# EAGLE design 14140^3 (EAGLE 7.5.0)
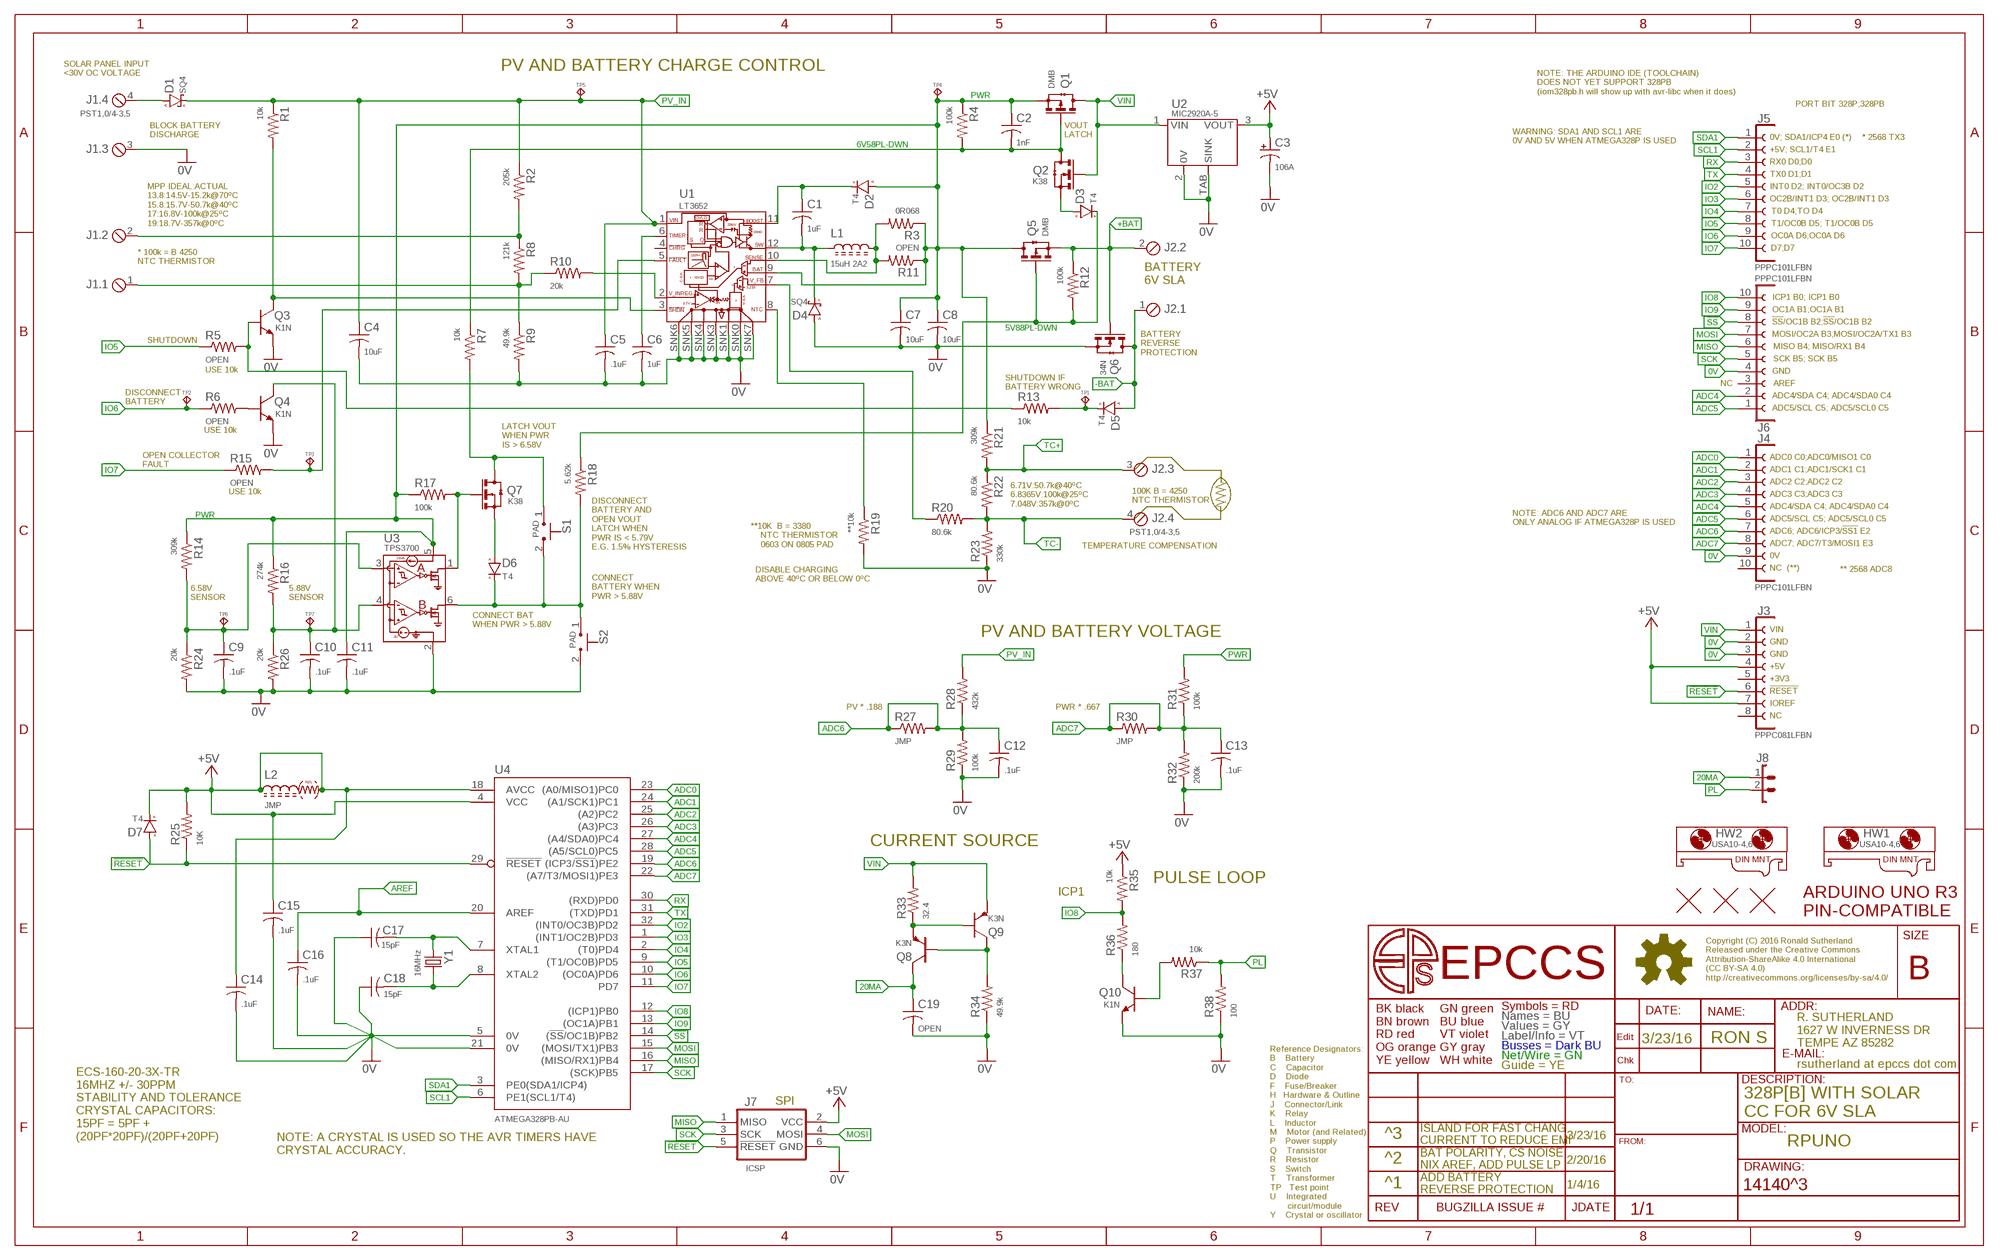
[diagram p0: schematic, sheet 1]

## Parts
C1  1uF  CC0805A  [C0805(2012)]
C2  1nF  CC0603A  [C0603(1608)]
C3  106A  CT1206  [3216]
C4  10uF  CC1206  [C1206(3216)]
C5  .1uF  CC0805A  [C0805(2012)]
C6  1uF  CC0805A  [C0805(2012)]
C7  10uF  CC1206  [C1206(3216)]
C8  10uF  CC1206  [C1206(3216)]
C9  .1uF  CC0603A  [C0603(1608)]
C10  .1uF  CC0603A  [C0603(1608)]
C11  .1uF  CC0603A  [C0603(1608)]
C12  .1uF  CC0603A  [C0603(1608)]
C13  .1uF  CC0603A  [C0603(1608)]
C14  .1uF  CC0603A  [C0603(1608)]
C15  .1uF  CC0603A  [C0603(1608)]
C16  .1uF  CC0603A  [C0603(1608)]
C17  15pF  CC0603A  [C0603(1608)]
C18  15pF  CC0603A  [C0603(1608)]
C19  OPEN  CC0805A  [C0805(2012)]
D1  SQ4  DSMA  [SMA]
D2  T4  DSOD123  [SOD123]
D3  T4  DSOD123  [SOD123]
D4  SQ4  DSMA  [SMA]
D5  T4  DSOD123  [SOD123]
D6  T4  DSOD123  [SOD123]
D7  T4  DSOD123  [SOD123]
HW1  USA10-4,6  MOUNT-HOLE5.0  [USA10]
HW2  USA10-4,6  MOUNT-HOLE5.0  [USA10]
J1  PST1,0/4-3,5  MCV4  [MCV4]
J2  PST1,0/4-3,5  MCV4  [MCV4]
J3  PPPC081LFBN  F1X8  [F1X8]
J4  PPPC101LFBN  F1X10  [F1X10]
J5  PPPC101LFBN  F1X10  [F1X10]
J6  PPPC101LFBN  F1X10  [F1X10]
J7  ICSP  ISP-SPIPTH  [ISP]
J8  1X2  [1X2]
L1  15uH 2A2  L3939  [L3939]
L2  JMP  L0805  [C0805(2012)]
Q1  DMB  N-CHSOT23  [SOT23]
Q2  K38  N-CHSOT23  [SOT23]
Q3  K1N  NPNSOT23  [SOT23]
Q4  K1N  NPNSOT23  [SOT23]
Q5  DMB  N-CHSOT23  [SOT23]
Q6  34N  N-CHSOT23  [SOT23]
Q7  K38  N-CHSOT23  [SOT23]
Q8  K3N  PNPSOT23  [SOT23]
Q9  K3N  PNPSOT23  [SOT23]
Q10  K1N  NPNSOT23  [SOT23]
R1  10k  R0805  [C0805(2012)]
R2  205k  R0805  [C0805(2012)]
R3  0R068  R1210  [C1210(3225)]
R4  100k  R0805  [C0805(2012)]
R5  OPEN  R0805  [C0805(2012)]
R6  OPEN  R0805  [C0805(2012)]
R7  10k  R0805  [C0805(2012)]
R8  121k  R0805  [C0805(2012)]
R9  49.9k  R0805  [C0805(2012)]
R10  20k  R0805  [C0805(2012)]
R11  OPEN  R1210  [C1210(3225)]
R12  100k  R0805  [C0805(2012)]
R13  10k  R0805  [C0805(2012)]
R14  309k  R0805  [C0805(2012)]
R15  OPEN  R0805  [C0805(2012)]
R16  274k  R0805  [C0805(2012)]
R17  100k  R0805  [C0805(2012)]
R18  5.62k  R0805  [C0805(2012)]
R19  **10k  R0805  [C0805(2012)]
R20  80.6k  R0805  [C0805(2012)]
R21  309k  R0805  [C0805(2012)]
R22  80.6k  R0805  [C0805(2012)]
R23  330k  R0805  [C0805(2012)]
R24  20k  R0805  [C0805(2012)]
R25  10K  R0805  [C0805(2012)]
R26  20k  R0805  [C0805(2012)]
R27  JMP  R0805  [C0805(2012)]
R28  432k  R0805  [C0805(2012)]
R29  100k  R0805  [C0805(2012)]
R30  JMP  R0805  [C0805(2012)]
R31  100k  R0805  [C0805(2012)]
R32  200k  R0805  [C0805(2012)]
R33  32.4  R0805  [C0805(2012)]
R34  49.9k  R0805  [C0805(2012)]
R35  10k  R0805  [C0805(2012)]
R36  180  R0805  [C0805(2012)]
R37  10k  R0805  [C0805(2012)]
R38  100  R0805  [C0805(2012)]
S1  PAD  TAC_SWSMD  [C0805(2012)]
S2  PAD  TAC_SWSMD  [C0805(2012)]
TP1  TPPAD1-08  [P1-08]
TP2  TPPAD1-08  [P1-08]
TP3  TPPAD1-08  [P1-08]
TP4  TPPAD1-08  [P1-08]
TP5  TPPAD1-08  [P1-08]
TP6  TPPAD1-08  [P1-08]
TP7  TPPAD1-08  [P1-08]
U1  LT3652  [12MSOP-EDP-HAND]
U2  MIC2920A-5  MIC2920SOT223  [SOT223]
U3  TPS3700  TPS3700DDCR  [SOT23-6]
U4  ATMEGA328PB-AU  [TQFP32-08]
U$1  ARDUINO-UNO  [ARDUINO_UNO]
U$2  FIDUCIAL1.27  [FIDUCIAL-1.27]
U$3  FIDUCIAL1.27  [FIDUCIAL-1.27]
U$4  FIDUCIAL1.27  [FIDUCIAL-1.27]
Y1  16MHz  CSM-3X  [CSM-3X]

## Nets
0V: C3.- C4.2 C5.2 C6.2 C7.2 C8.2 C9.2 C10.2 C11.2 C12.2 C13.2 C14.2 C15.2 C16.2 C17.1 C18.1 C19.2 D4.A J1.3 J3.2 J3.3 J4.9 J6.4 J7.6(GND) Q3.E Q4.E Q6.2(S)(S) Q10.E R9.2 R19.2 R23.1 R24.2 R26.2 R29.1 R32.1 R34.1 R38.1 S2.2 U1.SNK0(0V) U1.SNK1(0V) U1.SNK3(0V) U1.SNK4(0V) U1.SNK5(0V) U1.SNK6(0V) U1.SNK7(0V) U2.2(0V) U2.TAB(SINK) U3.2(0V) U4.5(0V) U4.21(0V)
5V88PL-DWN: D3.C(K) Q5.1(G)(G) R12.2 R18.1
6V58PL-DWN: C2.2 Q1.1(G)(G) Q2.3(D)(D) R4.2 R7.1
20MA: C19.1 J8.1 Q8.C
!FAULT: R15.2 TP3.TP U1.5(!FAULT)
!RESET!: D7.A J3.6 J7.5(!RESET) R25.1 U4.29(!RESET)
!SS: J6.8 U4.14((!SS!/OC1B)PB2)
+5V: C3.+ C14.1 C15.1 D7.C(K) J3.4 J3.7 J7.2(VCC) L2.1 L2.2 R25.2 R35.1 U2.3(VOUT) U4.4(VCC) U4.18(AVCC)
+BAT: J2.2 Q5.2(S)(S) Q6.1(G)(G) R12.1
-BAT: D5.A J2.1 Q6.3(D)(D)
ADC0: J4.1 U4.23((A0/MISO1)PC0)
ADC1: J4.2 U4.24((A1/SCK1)PC1)
ADC2: J4.3 U4.25((A2)PC2)
ADC3: J4.4 U4.26((A3)PC3)
ADC4: J4.5 J6.2 U4.27((A4/SDA0)PC4)
ADC5: J4.6 J6.1 U4.28((A5/SCL0)PC5)
ADC6: C12.1 J4.7 R27.1 R27.2 R28.1 R29.2 U4.19((ICP3/!SS1!)PE2)
ADC7: C13.1 J4.8 R30.1 R30.2 R31.1 R32.2 U4.22((A7/T3/MOSI1)PE3)
AREF: C16.1 U4.20(AREF)
IO2: J5.5 U4.32((INT0/OC3B)PD2)
IO3: J5.6 U4.1((INT1/OC2B)PD3)
IO4: J5.7 U4.2((T0)PD4)
IO5: J5.8 R5.1 U4.9((T1/OC0B)PD5)
IO6: J5.9 R6.1 TP2.TP U4.10((OC0A)PD6)
IO7: J5.10 R15.1 U4.11(PD7)
IO8: J6.10 R35.2 R36.2 U4.12((ICP1)PB0)
IO9: J6.9 U4.13((OC1A)PB1)
MISO: J6.6 J7.1(MISO) U4.16((MISO/RX1)PB4)
MOSI: J6.7 J7.4(MOSI) U4.15((MOSI/TX1)PB3)
N$1: C6.1 U1.6(TIMER)
N$2: R20.1 U1.7(V_FB)
N$3: J1.1 R8.2 R9.1 R10.1
N$4: Q3.C R1.2 U1.3(!SHDN)
N$5: D1.A J1.4
N$6: Q4.B R6.2
N$7: C10.1 Q4.C R16.2 R26.1 TP7.TP U3.4(INB)
N$8: D3.A Q2.2(S)(S)
N$9: J1.2 R2.2 R8.1
N$10: C1.1 D2.C(K) U1.11(BOOST)
N$11: R10.2 U1.2(V_INREG)
N$12: Q8.E Q9.B R33.1
N$13: D5.C(K) R13.2 TP1.TP
N$14: D6.A Q7.2(S)(S)
N$15: C9.1 R14.2 R24.1 TP6.TP U3.3(INA)
N$16: Q7.1(G)(G) R17.2 U3.1(OUTA)
N$17: D6.C(K) R18.2 S1.2 S2.1 U3.6(OUTB)
N$18: Q7.3(D)(D) R7.2 S1.1
N$19: Q8.B Q9.C R34.2
N$21: Q10.B R37.2
N$22: Q10.C R36.1
N$46: Q3.B R5.2 R13.1
N$115: C17.2 U4.7(XTAL1) Y1.1
N$116: C18.2 U4.8(XTAL2) Y1.2
NTC1: R19.1 U1.8(NTC)
PL: J8.2 R37.1 R38.2
PV_IN: C4.1 C5.1 D1.K R1.1 R2.1 R28.2 TP5.TP U1.1(VIN)
PWR: C2.1 C7.1 C8.1 C11.1 D2.A Q1.2(S)(S) Q5.3(D)(D) R3.1 R4.1 R11.1 R14.1 R16.1 R17.1 R21.1 R31.2 TP4.TP U1.9(BAT) U3.5(VDD)
RX: J5.3 U4.30((RXD)PD0)
SCK: J6.5 J7.3(SCK) U4.17((SCK)PB5)
SCL1: J5.2 U4.6(PE1(SCL1/T4))
SDA1: J5.1 U4.3(PE0(SDA1/ICP4))
SENSE: L1.2 R3.2 R11.2 U1.10(SENSE)
SW: C1.2 D4.K L1.1 U1.12(SW)
TC+: J2.3 R21.2 R22.1
TC-: J2.4 R20.2 R22.2 R23.2
TX: J5.4 U4.31((TXD)PD1)
VIN: J3.1 Q1.3(D)(D) Q2.1(G)(G) Q9.E R33.2 U2.1(VIN)
Unconnected: J3.5 J3.8 J4.10 J6.3 U1.4(!CHRG)

## Notes on the sheet
- PV AND BATTERY CHARGE CONTROL
- SOLAR PANEL INPUT
  <30V OC VOLTAGE
- NOTE: THE ARDUINO IDE (TOOLCHAIN)
  DOES NOT YET SUPPORT 328PB
  (iom328pb.h will show up with avr-libc when it does)
- PORT BIT 328P;328PB
- BLOCK BATTERY
  DISCHARGE
- VOUT 
  LATCH
- 0V; SDA1/ICP4 E0 (*) | * 2568 TX3
- WARNING: SDA1 AND SCL1 ARE 
  0V AND 5V WHEN ATMEGA328P IS USED
- +5V; SCL1/T4 E1
- RX0 D0;D0
- TX0 D1;D1
- INT0 D2; INT0/OC3B D2
- OC2B/INT1 D3; OC2B/INT1 D3
- T0 D4;TO D4
- MPP IDEAL:ACTUAL
  13.8:14.5V-15.2k@70ºC
  15.8:15.7V-50.7k@40ºC
  17:16.8V-100k@25ºC
  19:18.7V-357k@0ºC
- T1/OC0B D5; T1/OC0B D5
- OC0A D6;OC0A D6
- D7;D7
- * 100k = B 4250
  NTC THERMISTOR
- BATTERY
  6V SLA
- ICP1 B0; ICP1 B0
- OC1A B1;OC1A B1
- !SS!/OC1B B2;!SS!/OC1B B2
- MOSI/OC2A B3;MOSI/OC2A/TX1 B3
- SHUTDOWN
- MISO B4; MISO/RX1 B4
- BATTERY
  REVERSE 
  PROTECTION
- SCK B5; SCK B5
- USE 10k | GND
- NC | AREF
- SHUTDOWN IF
  BATTERY WRONG
- ADC4/SDA C4; ADC4/SDA0 C4
- DISCONNECT 
  BATTERY
- ADC5/SCL C5; ADC5/SCL0 C5
- USE 10k
- LATCH VOUT
  WHEN PWR 
  IS > 6.58V
- ADC0 C0;ADC0/MISO1 C0
- OPEN COLLECTOR
  FAULT
- ADC1 C1;ADC1/SCK1 C1
- ADC2 C2;ADC2 C2
- USE 10k
- ADC3 C3;ADC3 C3
- 100K B = 4250
  NTC THERMISTOR
- 6.71V:50.7k@40ºC
  6.8365V:100k@25ºC
  7.048V:357k@0ºC
- ADC4/SDA C4; ADC4/SDA0 C4
- ADC5/SCL C5; ADC5/SCL0 C5
- NOTE: ADC6 AND ADC7 ARE 
  ONLY ANALOG IF ATMEGA328P IS USED
- ADC6; ADC6/ICP3/!SS1! E2
- ADC7; ADC7/T3/MOSI1 E3
- **10K  B = 3380
      NTC THERMISTOR
      0603 ON 0805 PAD
- TEMPERATURE COMPENSATION
- DISCONNECT 
  BATTERY AND 
  OPEN VOUT 
  LATCH WHEN 
  PWR IS < 5.79V
  E.G. 1.5% HYSTERESIS
- 0V
- NC  (**) | ** 2568 ADC8
- DISABLE CHARGING
  ABOVE 40ºC OR BELOW 0ºC
- CONNECT 
  BATTERY WHEN
  PWR > 5.88V
- 6.58V
  SENSOR
- 5.88V 
  SENSOR
- CONNECT BAT
  WHEN PWR > 5.88V
- VIN
- PV AND BATTERY VOLTAGE
- GND
- GND
- +5V
- +3V3
- !RESET
- IOREF
- PV * .188 | PWR * .667
- NC
- CURRENT SOURCE
- PULSE LOOP
- ICP1
- 3/23/16 | RON S
- SPI
- 328P[B] WITH SOLAR 
  CC FOR 6V SLA
- ^3 | 3/23/16
- ECS-160-20-3X-TR
  16MHZ +/- 30PPM
  STABILITY AND TOLERANCE
  CRYSTAL CAPACITORS:
  15PF = 5PF +
  (20PF*20PF)/(20PF+20PF)
- ISLAND FOR FAST CHANG
  CURRENT TO REDUCE EMI
- RPUNO
- NOTE: A CRYSTAL IS USED SO THE AVR TIMERS HAVE 
  CRYSTAL ACCURACY.
- ^2 | 2/20/16
- BAT POLARITY, CS NOISE
  NIX AREF, ADD PULSE LP
- ^1 | 1/4/16
- ADD BATTERY 
  REVERSE PROTECTION

## Library data of the parts
C1 C2 C4-C19 = C-C:C: CAPACITOR Symbol
C3 = C-T:CT: Tantalum Electrolytic Capacitor
D1 D4 = D-SBR:D: DIODE
D2 D3 D5-D7 = D-GP:D: DIODE
HW1 HW2 = HW-DINMnt:MOUNT-HOLE: USA10-4.6 [PhxCont,1202713] DINRAIL ADAPTER UNIVERSAL 10MM 4.6MM
J1 J2 = J-HDR3.5mm:MCV4: MCV 1,5/4-G-3,5-RN [PHOENIX CONTACT,1843622] CONN HEADER SHROUDED 2POS 3.5MM PST 1,0/4-3,5 [PHOENIX CONTACT,1945119] CONN HEADER STRIP PIN 4POS 3.5MM MCVR 1,5& 4-ST-3,5 [PHOENIX CONTACT,1863178] CONN PLUG 4POS SCREW 3.5MM
J3 = J-HDR2.54mm:F1X8: FEMALE HEADER 8POS
J4-J6 = J-HDR2.54mm:F1X10: FEMALE HEADER 10POS
J7 = U-AVR:ISP-SPI: AVR ISP thru SPI In-System Programming uses the target Atmel AVR’s internal SPI (Serial Peripheral Interface) to download code into the flash and EEPROM memories. It is not a debugging interface. When designing an application PCB which includes an AVR with the SPI interface, this pinout should be used. Sparkfun SKU: BOB-08508
J8 = J-HDR2.54mm:1X2
L1 = L-PSMD:L: Inductor
L2 = L-FB:L: Ferrite Bead with frequency dependent resistance
Q1 Q5 = Q-PCH:N-CH?*: ENHANCEMENT MODE MOSFET SOT23 is BSS138 pinout
Q2 Q6 Q7 = Q-NCH:N-CH?*: ENHANCEMENT MODE MOSFET SOT23 is BSS138 pinout
Q3 Q4 Q10 = Q-NPN:NPN: BJT NPN General Purpose Amplifier
Q8 Q9 = Q-PNP:PNP: BJT NPN General Purpose Amplifier
R1-R38 = R-C:R: Resiistor American-style symbol
S1 S2 = S-Tactile:TAC_SW: KS11 [C&K,KS11R21CQE] SWITCH PUSHBUTTON SPST-NO 25MA 50V PAD 0805
TP1-TP7 = J-TP:TP: Test pad
U1 = U-BUCK:LT3652: 3652 [LINEAR,LT3652EMSE] BUCK BATT CHARGE CONTROLLER 12MSOP
U2 = P-DCDC:MIC2920: Bulletproof Low Dropout Voltage Regulator MIC2920A-5 [MICREL,MIC2920A-5.0WS] REG 5V LDO 0V4@0A4 SOT223 NOTE: The heat sink is grounded and is thus not pin compatable with LD1117 or ilk
U3 = U-Linear:TPS3700: PXVQ [TI,TPS3700DDCR] WINDOW COMPARATOR 6SOT
U4 = U-AVR:ATMEGA328PB-AU: ATmega328PB 4 Kbytes FLASH 128 bytes SRAM 256 bytes EEPROM 2 UART, 2 I2C, 2 SPI 8-channel 10 bit ADC
U$1 = J-BoardHDR:ARDUINO-UNO: Board Outline with holes and silk note the board dim layer is not defined
U$2-U$4 = H-Fiducial:FIDUCIAL: Fiducial Alignment Points Various fiducial points for machine vision alignment.
Y1 = Y-XTL:CSM: 16MHZ20 [ECS,ECS-160-20-3X-TR] CRYSTAL 16MHZ 20PF 30PPM CSM-3X

## Net classes
0 default: width 0.254 mm, drill 0.33 mm

## Board
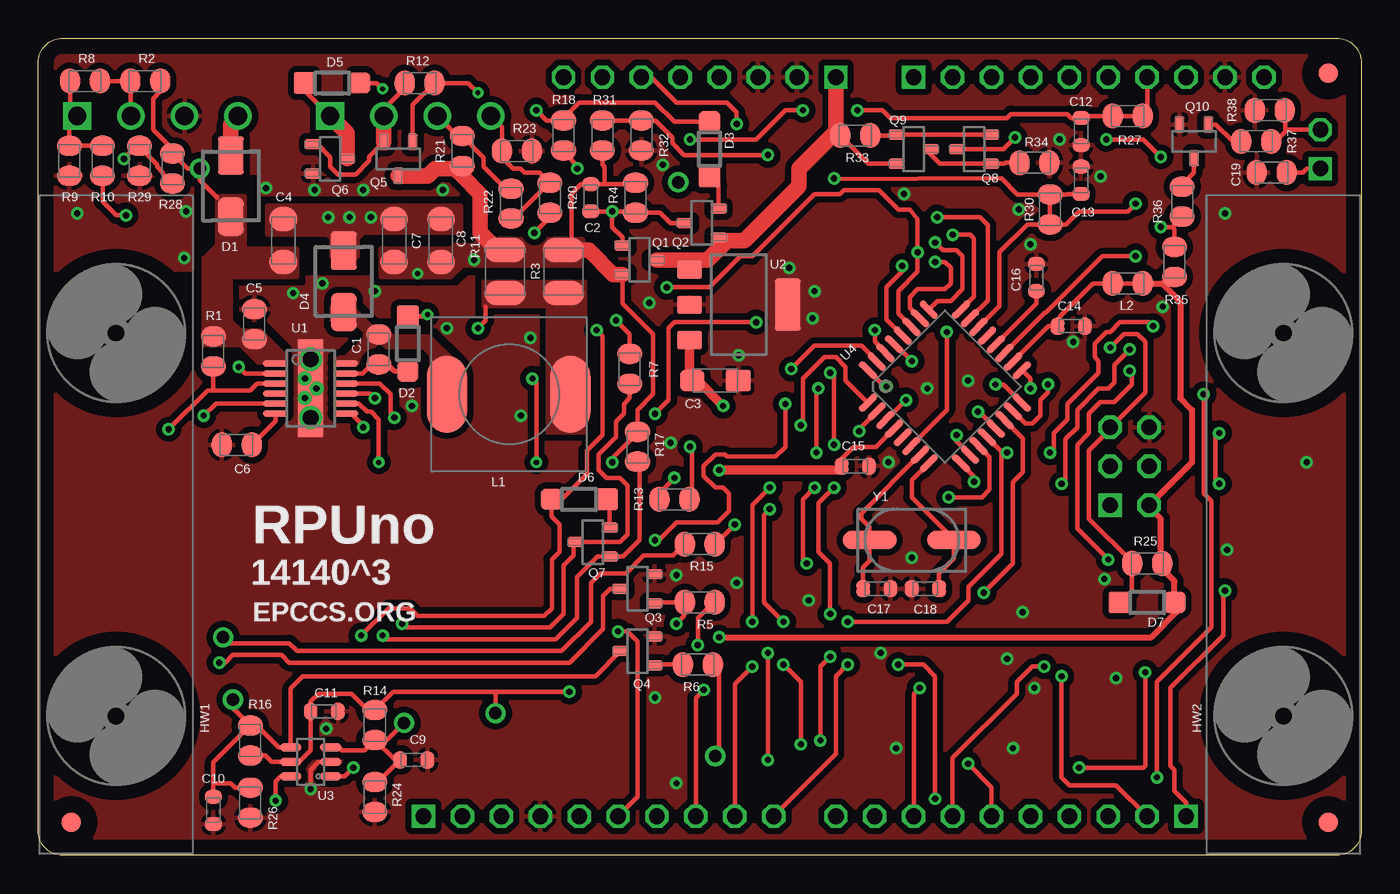
[diagram p1: board, top side]
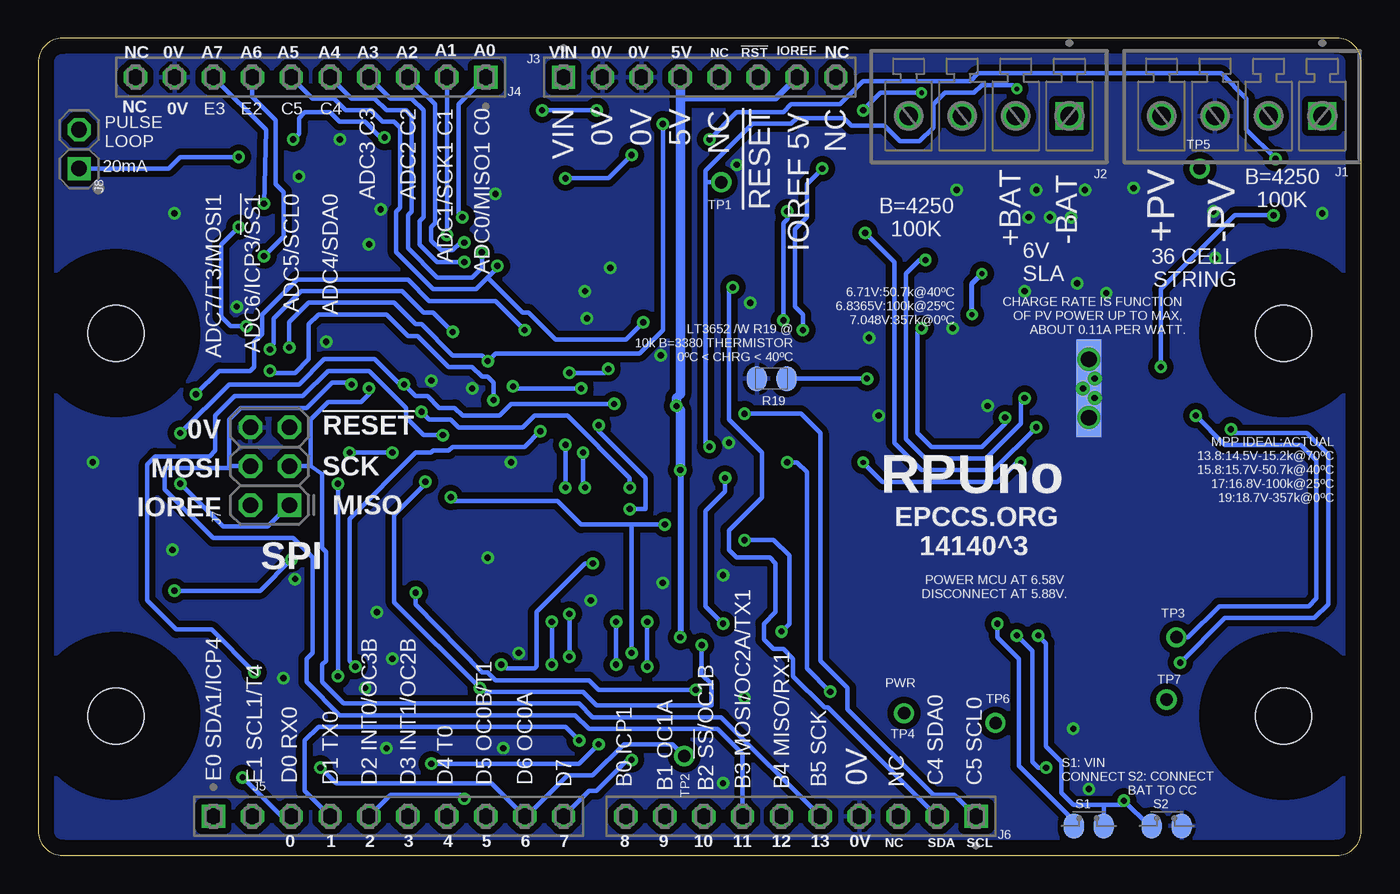
[diagram p2: board, bottom side, seen from below]

Size 86.36 x 53.34 mm. Coordinates in mm from the lower left corner, seen from the top.
Outline: 86.36,51.75 86.36,1.59 arc-90 84.77,0 1.59,0 arc-90 0,1.59 0,51.75 arc-90 1.59,53.34 84.77,53.34 arc-90 86.36,51.75
Copper layers (1*16): Top 0.034290625mm / dielectric 60mil / Bottom 0.034290625mm
Design rules "default *": minimum track width 10mil, minimum drill 13mil, track to track 12mil, track to pad 10mil, pad to pad 8mil, via to via 12mil, smd to smd 8mil, copper to edge 40mil, drill to drill 16mil, minimum pad ring 10mil, minimum via ring 8mil, stop-mask expansion 4mil, vias tented up to drill 17mil, thermal gap 10mil

### Footprints (pad centres in the part's own frame; a part is rotated, then mirrored left to right if it is on the bottom)
C0805(2012) = smd 1.321 x 1.651: 1 -0.977,0; 2 0.977,0
C0603(1608) = smd 0.898 x 1.1: 1 -0.889,0; 2 0.889,0
3216 = smd 1.6 x 1.4: + -1.5,0; - 1.5,0
C1206(3216) = smd 1.6 x 1.8: 1 -1.4,0; 2 1.4,0
SMA = smd 2.5 x 1.7: A 2,0; K -2,0
SOD123 = smd 1.4 x 1.4: A 1.8,0; C -1.8,0
USA10 = hole 3.658: -12.5,0; 12.5,0
MCV4 = drill 1.2 square: 1 0,0 | drill 1.2: 2 3.5,0; 3 7,0; 4 10.5,0
F1X8 = drill 1.016 square: 1 0,0 | drill 1.016 octagon: 2 2.54,0; 3 5.08,0; 4 7.62,0; 5 10.16,0; 6 12.7,0; 7 15.24,0; 8 17.78,0
F1X10 = drill 1.016 square: 1 0,0 | drill 1.016 octagon: 2 2.54,0; 3 5.08,0; 4 7.62,0; 5 10.16,0; 6 12.7,0; 7 15.24,0; 8 17.78,0; 9 20.32,0; 10 22.86,0
ISP = drill 1.016 square: 1 0,0 | drill 1.016 octagon: 2 0,2.54; 3 2.54,0; 4 2.54,2.54; 5 5.08,0; 6 5.08,2.54
1X2 = drill 1.016 square: 1 0,0 | drill 1.016 octagon: 2 2.54,0
L3939 = smd 2.6 x 5: 1 4.05,0; 2 -4.01,0
SOT23 = smd 0.65 x 1.06: 1(G) -0.95,-1.1; 2(S) 0.95,-1.1; 3(D) 0,1.1
SOT23' = smd 0.65 x 1.06: B -0.95,-1.1; C 0,1.1; E 0.95,-1.1
C1210(3225) = smd 1.6 x 2.7: 1 -1.4,0; 2 1.4,0
P1-08 = drill 0.813: TP 0,0
12MSOP-EDP-HAND = smd 0.42 x 1.6: 1 -1.625,-2.3; 2 -0.975,-2.3; 3 -0.325,-2.3; 4 0.325,-2.3; 5 0.975,-2.3; 6 1.625,-2.3; 7 1.625,2.3; 8 0.975,2.3; 9 0.325,2.3; 10 -0.325,2.3; 11 -0.975,2.3; 12 -1.625,2.3 | smd 6.35 x 1.651: SNK0 0,0 | smd 6.35 x 1.651 bottom: SNK1 0,0 | drill 1.016: SNK3 -1.905,0; SNK5 1.905,0 | drill 0.406: SNK4 0,0.381; SNK6 -0.635,-0.381; SNK7 0.635,-0.381
SOT223 = smd 1.2 x 1.6: 1 -2.3,-3.2; 2 0,-3.2; 3 2.3,-3.2 | smd 3.4 x 1.7: TAB 0,3.2
SOT23-6 = smd 0.55 x 1.4: 1 -0.95,-1.3; 2 0,-1.3; 3 0.95,-1.3; 4 0.95,1.3; 5 0,1.3; 6 -0.95,1.3
TQFP32-08 = smd 1.5 x 0.45: 1 -4.293,2.8; 2 -4.293,2; 3 -4.293,1.2; 4 -4.293,0.4; 5 -4.293,-0.4; 6 -4.293,-1.2; 7 -4.293,-2; 8 -4.293,-2.8; 17 4.293,-2.8; 18 4.293,-2; 19 4.293,-1.2; 20 4.293,-0.4; 21 4.293,0.4; 22 4.293,1.2; 23 4.293,2; 24 4.293,2.8 | smd 0.45 x 1.5: 9 -2.8,-4.293; 10 -2,-4.293; 11 -1.2,-4.293; 12 -0.4,-4.293; 13 0.4,-4.293; 14 1.2,-4.293; 15 2,-4.293; 16 2.8,-4.293; 25 2.8,4.293; 26 2,4.293; 27 1.2,4.293; 28 0.4,4.293; 29 -0.4,4.293; 30 -1.2,4.293; 31 -2,4.293; 32 -2.8,4.293
FIDUCIAL-1.27 = smd 1.27 x 1.27: 1 0,0
CSM-3X = smd 3.5 x 1.2: 1 -2.75,0; 2 2.75,0

### Placement (x,y rotation side)
C1  22.23,33.02 90 top
C2  36.07,42.93 270 top
C3  44.2,30.99 0 top
C4  16,40.13 90 top
C5  14.1,34.67 90 top
C6  12.95,26.8 180 top
C7  23.24,40.13 90 top
C8  26.29,40.13 90 top
C9  24.51,6.22 0 top
C10  11.43,2.92 270 top
C11  18.67,9.4 0 top
C12  68.07,47.24 270 top
C13  68.07,44.07 90 top
C14  67.44,34.54 0 top
C15  53.34,25.4 0 top
C16  65.15,37.72 90 top
C17  54.74,17.4 180 top
C18  57.91,17.4 0 top
C19  80.52,44.58 180 top
D1  12.57,43.69 90 top
D2  24.13,33.4 90 top
D3  43.81,46.1 270 top
D4  19.94,37.47 90 top
D5  19.18,50.42 180 top
D6  35.31,23.24 0 top
D7  72.39,16.51 180 top
HW1  5.08,21.59 90 top
HW2  81.28,21.59 90 top
J1  2.54,48.26 180 bottom
J2  19.05,48.26 180 bottom
J3  52.07,50.8 0 bottom
J4  57.15,50.8 180 bottom
J5  74.93,2.54 0 bottom
J6  25.15,2.54 180 bottom
J7  69.98,22.86 90 bottom
J8  83.69,44.83 90 bottom
L1  30.73,30.1 180 top
L2  71.12,37.34 180 top
Q1  39.24,38.86 270 top
Q2  43.31,41.27 90 top
Q3  K1N  [SOT23']  39.12,17.4 90 top
Q4  K1N  [SOT23']  39.12,13.34 90 top
Q5  23.5,45.47 180 top
Q6  19.05,45.47 270 top
Q7  36.2,20.45 90 top
Q8  K3N  [SOT23']  61.09,46.1 90 top
Q9  K3N  [SOT23']  57.15,46.1 270 top
Q10  K1N  [SOT23']  75.44,46.61 180 top
R1  11.43,32.89 270 top
R2  6.99,50.55 180 top
R3  34.29,38.1 270 top
R4  38.99,42.93 270 top
R5  43.18,16.51 180 top
R6  43.05,12.45 180 top
R7  38.61,31.75 270 top
R8  3.05,50.55 180 top
R9  2.03,45.34 270 top
R10  4.19,45.34 270 top
R11  30.48,38.1 270 top
R12  24.89,50.42 0 top
R13  41.53,23.24 0 top
R14  21.97,8.51 270 top
R15  43.18,20.32 180 top
R16  13.84,7.49 90 top
R17  39.12,26.67 270 top
R18  34.29,46.99 270 top
R19  38.48,31.11 180 bottom
R20  33.4,42.93 90 top
R21  27.69,45.97 90 top
R22  30.86,42.55 270 top
R23  31.24,45.97 180 top
R24  21.97,3.81 270 top
R25  72.39,19.05 0 top
R26  13.84,3.43 270 top
R27  71.12,48.26 180 top
R28  8.76,44.83 90 top
R29  6.6,45.34 90 top
R30  66.04,42.16 90 top
R31  36.83,46.99 270 top
R32  39.37,46.99 90 top
R33  53.34,46.99 180 top
R34  65.02,45.21 180 top
R35  74.17,38.73 90 top
R36  74.68,42.67 270 top
R37  79.5,46.61 180 top
R38  80.39,48.64 0 top
S1  17.78,1.91 0 bottom
S2  12.7,1.91 0 bottom
TP1  41.78,43.94 0 bottom
TP2  44.2,6.48 0 bottom
TP3  12.06,14.22 0 bottom
TP4  29.84,9.27 0 bottom
TP5  10.54,44.83 0 bottom
TP6  23.88,8.64 0 bottom
TP7  12.7,10.16 0 bottom
U1  17.78,30.48 270 top
U2  45.72,35.94 270 top
U3  17.78,6.1 90 top
U4  59.18,30.61 45 top
U$1  6.35,53.34 180 bottom
U$2  84.2,51.05 0 top
U$3  2.16,2.16 0 top
U$4  84.2,2.16 0 top
Y1  57.02,20.57 0 top

### Tracks (layer width: path | path; a pad name or v marks a point on that pad's centre or on a via)
0V  (via drill 0.41)
  Top 0.305: v17.78,4.32 17.78,5.59 18.29,6.1 U3.2
  other vias: 2.54,41.91 21.72,41.66 20.32,41.66 18.92,41.66 18.8,8.26 66.67,46.74 73.41,35.81 82.8,25.65 55.5,25.65 40.77,45.09 64.77,39.88 60.71,30.99 58.04,30.48 77.6,19.94 69.6,18.03 64.26,15.88 63.25,12.83 70.36,11.56 65.02,10.92 63.63,6.99 40.26,10.29 41.66,18.29 45.59,17.78 41.27,26.92 57.02,19.43 49.02,38.35 50.67,36.83 50.55,35.05 45.72,32.64 39.88,36.07 56.52,43.18 69.34,44.32 64.01,42.16 50.29,16.64 41.66,4.7 56.01,6.99 54.99,13.21 32.13,33.78 26.67,34.42 31.5,28.7 24.38,29.34 67.56,33.53 77.47,41.91 21.97,36.83 18.54,37.34 16.64,36.7 9.53,38.99 21.21,43.43 18.03,43.43 14.86,43.56 9.65,42.04 26.42,43.43
  pour Bottom (isolate 0.406): 0,53.34 86.36,53.34 86.36,0 0,0
  pour Top (isolate 0.406, rank 6): 0,53.34 86.36,53.34 86.36,0 0,0 0,37.72 36.83,37.72 36.83,44.45 27.94,44.45 27.94,43.18 14.48,43.18 14.48,44.58 10.03,44.58 10.03,38.23 0,38.23
  pour Top (no thermals): 14.99,42.42 27.56,42.42 27.56,40.64 21.21,40.64 20.83,40.26 20.83,39.12 20.57,38.86 19.43,38.86 19.18,39.12 19.18,40.26 18.92,40.51 14.99,40.51
5V88PL-DWN  (via drill 0.3, 0.41)
  Top 0.305: v32.51,48.64 33.19,47.97 R18.1 34.16,48.01 35.31,49.15 40.26,49.15 41.53,47.88 43.79,47.88 D3.C | v28.7,49.78 28.07,50.42 R12.2 24.45,48.99 Q5.1(G)
  Bottom 0.305: v32.51,48.64 31.37,49.78 v28.7,49.78
6V58PL-DWN  (via drill 0.41)
  Top 0.305: C2.2 v37.47,42.04 | v37.47,42.04 39.16,42.04 R4.2 40.6,41.95 41.27,41.27 Q2.3(D) | R7.1 38.61,34.04 v37.72,34.92 | Q1.1(G) 38.14,40.34 37.47,41.02 v37.47,42.04
  Bottom 0.305: v37.72,34.92 37.72,41.27 37.47,41.53 v37.47,42.04
20MA  (via drill 0.41)
  Top 0.305: J8.1 82.8,44.83 82.55,44.58 C19.1 | Q8.C 62.99,46.1 v63.75,46.86 | v69.72,46.74 72.14,46.74 v73.28,45.59
  Bottom 0.305: v63.75,46.86 64.01,46.86 65.02,47.88 66.67,47.88 67.31,48.51 68.96,48.51 69.34,48.13 69.34,47.12 v69.72,46.74 | v73.28,45.59 77.09,45.59 77.85,44.83 J8.1
!FAULT  (via drill 0.41)
  Top 0.305: U1.5 11.6,29.5 v10.79,28.7 | R15.2 41.44,19.56 39.5,19.56 38.35,18.41 36.7,18.41 36.07,17.78 36.07,15.24 34.16,13.34 16.89,13.34 16.38,13.84 12.45,13.84 TP3.TP
  Bottom 0.305: v10.79,28.7 8.89,26.8 3.94,26.8 2.92,25.78 2.92,16.76 3.43,16.26 9.27,16.26 11.3,14.22 TP3.TP
!RESET!  (via drill 0.41)
  Top 0.305: D7.A 70.61,16.51 71.37,17.27 71.37,19.05 R25.1 71.37,19.18 68.58,21.97 68.58,26.42 69.98,27.81 J7.5 72.26,30.23 72.26,33.53 71.75,34.04 70.87,34.04 v69.98,33.15 | v57.02,32.26 55.88,33.4 U4.29 | J3.6 40.01,50.8 41.66,49.15 44.96,49.15 45.59,48.51 v45.59,47.75
  Bottom 0.305: v69.98,33.15 69.98,34.8 68.71,36.07 63.12,36.07 61.72,34.67 61.34,34.67 59.31,32.64 57.4,32.64 v57.02,32.26 56.52,32.77 47.12,32.77 45.59,34.29 v45.59,47.75
!SS  (via drill 0.41)
  Top 0.305: v61.72,17.14 63.63,19.05 63.63,24.38 64.26,25.02 64.26,27.22 U4.14 | v43.43,10.79 42.93,10.29 J6.8
  Bottom 0.305: v61.72,17.14 61.72,16.38 57.4,11.94 57.02,11.94 56.52,11.43 50.42,11.43 49.78,10.79 v43.43,10.79
+5V  (via drill 0.41)
  Top 0.305: U4.4 54.68,26.67 53.21,26.67 52.45,25.91 C15.1 | U4.18 65.95,34.54 C14.1 66.67,35.18 68.83,37.34 L2.2 L2.1 | R35.1 73.79,37.76 73.37,37.34
  Top 0.406: v44.45,14.22 72.64,14.22 74.3,15.88 74.3,16.41 D7.C 74.17,16.53 74.17,17.91 73.37,18.71 R25.2 73.28,19.14 73.28,21.97 72.52,22.73 J7.2 75.31,25.65 75.31,29.08 74.55,29.84 74.55,36.16 73.37,37.34 L2.1
  Top 0.61: U2.3 42.52,31.16 C3.+ 43.05,30.99 v44.7,29.34 | v44.45,25.15 52.2,25.15 C15.1
  Bottom 0.406: J3.7 38.23,49.4 44.45,49.4 | v44.45,25.15 v44.45,14.22
  Bottom 0.61: J3.4 44.45,49.4 44.45,30.1 44.7,29.84 v44.7,29.34 44.45,29.08 v44.45,25.15
+BAT
  Top 0.305: R12.1 23.91,50.08 22.55,48.71 J2.2 | Q6.1(G) 18.23,46.42 19.05,45.59 19.05,44.96 19.56,44.45 20.7,44.45 21.59,45.34 21.59,45.61 Q5.2(S)
  Top 1.016: Q5.2(S) J2.2
-BAT
  Top 0.305: D5.A 17.38,49.93 J2.1
  Top 1.016: Q6.3(D) 20.15,47.16 J2.1
ADC0  (via drill 0.41)
  Top 0.305: U4.23 61.98,36.23 61.98,41.15 61.47,41.66 v58.67,41.66
  Bottom 0.305: v58.67,41.66 58.93,41.91 58.93,49.02 J4.1
ADC1  (via drill 0.41)
  Top 0.305: U4.24 61.09,36.47 61.09,40.26 60.83,40.51 v59.69,40.51
  Bottom 0.305: v59.69,40.51 J4.2
ADC2  (via drill 0.41)
  Top 0.305: U4.25 58.7,36.2 59.56,36.2 60.33,36.96 60.33,39.12 59.94,39.5 59.05,39.5 v58.55,40.01
  Bottom 0.305: v58.55,40.01 58.8,40.01 59.31,39.5 60.07,39.5 60.71,40.13 60.71,41.02 60.45,41.27 60.45,49.02 J4.3
ADC3  (via drill 0.41)
  Top 0.305: U4.26 56.9,35.72 56.9,36.45 57.4,36.96 59.18,36.96 59.56,37.34 59.56,38.35 59.18,38.73 v58.55,38.73
  Bottom 0.305: v58.55,38.73 60.33,38.73 61.47,39.88 61.47,41.4 61.21,41.66 61.21,48.64 61.98,49.4 63.37,49.4 J4.4
ADC4  (via drill 0.41)
  Top 0.305: U4.27 56.13,35.35 56.13,36.83 57.4,38.1 v57.4,39.37 57.4,41.53 56.9,42.16 56.13,42.16 54.86,43.43 52.58,43.43 52.32,43.18 50.67,43.18 46.61,39.12 45.85,39.12 43.81,37.08 v41.02,37.08
  Bottom 0.305: v57.4,39.37 57.4,38.35 58.04,37.72 60.33,37.72 62.23,39.62 62.23,41.78 61.98,42.04 61.98,48.26 62.36,48.64 63.63,48.64 64.39,49.4 65.91,49.4 J4.5 | J6.2 34.8,9.65 35.05,9.65 37.08,11.68 37.08,12.83 37.72,13.46 38.35,13.46 38.99,14.1 38.99,15.11 38.23,15.88 38.23,19.05 38.61,19.43 40.77,19.43 41.27,19.94 41.27,21.21 39.12,23.37 39.12,26.29 41.27,28.45 41.27,36.83 v41.02,37.08
ADC5  (via drill 0.41)
  Top 0.305: U4.28 55.37,34.98 55.37,37.08 56.39,38.1 v56.39,38.48 | v40.26,28.83 41.15,29.72 41.15,34.42 41.53,34.8 v46.86,34.8
  Bottom 0.305: v56.39,38.48 56.52,38.35 56.52,38.23 57.02,37.72 | 57.02,37.72 57.78,36.96 60.58,36.96 62.99,39.37 62.99,42.04 62.74,42.29 62.74,47.5 63.12,47.88 63.88,47.88 64.64,48.64 66.29,48.64 67.06,49.4 68.45,49.4 J4.6 | J6.1 26.54,3.94 27.94,3.94 33.53,9.53 33.53,10.92 35.31,12.7 35.31,27.56 36.58,28.83 v40.26,28.83 | v46.86,34.8 48.01,33.66 52.58,33.66 54.36,35.43 54.74,35.43 57.02,37.72
ADC6  (via drill 0.41)
  Top 0.305: U4.19 65.7,35.43 65.79,35.43 69.47,39.12 v71.63,39.12 | J4.7 72.39,48.55 R27.1 R27.2 68.2,48.26 C12.1 67.44,48.13 67.18,48.39 63.5,48.39 63.25,48.13 55.63,48.13 55.12,48.64 v53.47,48.64 | v42.55,46.74 46.86,46.74 48.77,48.64 v49.91,48.64 | v5.59,45.47 6.44,46.32 R29.2 6.6,46.23 7.75,45.09 7.75,44.96 8.13,44.58 8.13,44.49 R28.1
  Bottom 0.305: v71.63,39.12 70.36,40.39 70.36,43.31 70.87,43.81 70.87,48.01 72.39,49.53 J4.7 | v5.59,45.47 7.49,47.37 7.49,49.4 9.14,51.05 25.02,51.05 25.53,50.55 32.51,50.55 34.04,49.02 37.21,49.02 37.72,48.51 40.77,48.51 v42.55,46.74 | v49.91,48.64 v53.47,48.64
ADC7  (via drill 0.41)
  Top 0.305: U4.22 62.74,35.86 62.74,39.37 64.56,41.19 R30.1 | R30.1 67.09,41.19 67.94,42.04 71.12,42.04 v71.63,42.55 | R31.1 R32.2 40.3,47.97 41.4,46.86 41.4,46.48 42.16,45.72 v47.62,45.72 | C13.1 67.18,43.18 67.09,43.14 R30.2 | R30.2 63.92,43.14 62.87,44.2 51.98,44.16 v51.94,44.2 | R30.2 R30.1
  Bottom 0.305: v71.63,42.55 71.5,47.37 J4.8 | v51.94,44.2 49.15,44.2 v47.62,45.72
AREF
  Top 0.305: U4.20 65.15,36.01 C16.1
IO2  (via drill 0.41)
  Top 0.305: v55.37,30.61 55.24,30.61 54.23,31.62 U4.32 | v50.93,30.48 50.8,30.35 v50.8,26.29 | v50.16,19.05 49.91,19.3 49.91,23.24 v50.67,24 | v56.13,12.45 57.78,12.45 58.55,11.68 v58.55,3.68
  Bottom 0.305: v55.37,30.61 55.24,30.48 v50.93,30.48 | v50.8,26.29 50.8,24 v50.67,24 | v56.13,12.45 55.75,12.19 53.98,12.19 53.85,12.32 53.85,15.88 50.67,19.05 v50.16,19.05 | v58.55,3.68 58.8,3.94 63.37,3.94 J5.5
IO3  (via drill 0.41)
  Top 0.305: v49.78,28.07 49.91,28.19 49.91,31.11 51.31,32.51 52.07,32.51 52.7,31.88 52.7,30.99 54.1,29.59 U4.1 | v47.75,22.61 47.37,22.23 47.37,16.51 v48.64,15.24 | v48.64,12.45 49.78,11.3 v49.78,7.24 | v60.71,5.97 62.23,4.45 J5.6
  Bottom 0.305: v49.78,28.07 49.78,27.69 46.74,24.64 46.74,22.61 v47.75,22.61 | v48.64,12.45 v48.64,15.24 | v49.78,7.24 51.05,5.97 v60.71,5.97
IO4  (via drill 0.41)
  Top 0.305: v53.59,27.69 53.59,27.81 54.74,28.96 U4.2 | v65.66,12.32 64.9,12.32 63.88,11.3 63.88,10.54 59.69,6.35 J5.7
  Bottom 0.305: v53.59,27.69 54.61,26.67 59.31,26.67 59.56,26.42 60.58,26.42 60.71,26.29 61.72,26.29 66.04,21.97 66.04,12.7 v65.66,12.32
IO5  (via drill 0.41)
  Top 0.305: v57.53,10.92 57.15,10.54 J5.8 | v43.05,13.72 43.05,15.49 44.07,16.51 R5.1 | U4.9 61.09,24.74 v61.09,24.38
  Bottom 0.305: v61.09,24.38 61.09,24.26 63.12,22.23 63.12,16.51 v57.53,10.92 57.4,10.92 57.15,10.67 50.8,10.67 49.91,9.78 42.42,9.78 42.42,11.18 43.05,11.81 v43.05,13.72
IO6  (via drill 0.41)
  Top 0.305: v59.94,27.43 59.94,27.05 60.83,26.16 U4.10 | v67.94,5.71 72.14,5.71 72.26,5.84 v72.26,11.94 | R6.1 44.07,12.45 44.45,12.06 44.45,6.73 TP2.TP
  Bottom 0.305: v59.94,27.43 61.21,27.43 62.36,28.57 62.36,29.21 64.77,31.62 67.44,31.62 69.09,29.97 73.53,29.97 74.8,28.7 74.8,26.42 75.18,26.04 78.74,26.04 79.25,25.53 79.25,16.64 77.34,14.73 75.06,14.73 v72.26,11.94 | v67.94,5.71 66.93,4.7 56.77,4.7 J5.9 54.48,2.54 51.82,5.21 50.16,5.21 48.13,7.24 44.96,7.24 TP2.TP
IO7  (via drill 0.41)
  Top 0.305: v59.44,23.37 61.59,23.37 62.1,23.88 62.1,25.99 U4.11 | v45.47,21.59 44.2,20.32 R15.1 | v47.62,13.21 v47.62,6.22
  Bottom 0.305: v59.44,23.37 59.18,23.11 52.45,23.11 50.93,21.59 47.62,21.59 | v45.47,21.59 47.62,21.59 | J5.10 50.42,4.19 49.91,4.19 47.88,6.22 v47.62,6.22 | 47.62,21.59 v47.62,13.21
IO8  (via drill 0.41)
  Top 0.305: 62.87,26.29 62.87,19.68 60.71,17.53 60.71,16.64 59.31,15.24 v52.83,15.24 | 62.87,26.29 62.87,26.36 U4.12 | v52.83,12.45 52.07,11.68 52.07,6.6 J6.10 | 62.87,26.29 v63.25,26.29 | v66.04,26.29 66.29,26.54 66.29,27.56 67.18,28.45 67.18,29.46 69.22,31.5 69.22,32.26 68.96,32.51 68.96,33.4 69.72,34.16 69.98,34.16 70.61,34.8 72.52,34.8 v72.77,34.54 | R35.2 74.17,40.89 74.04,41.02 | v73.28,41.02 74.04,41.02 | R36.2 74.68,41.66 74.04,41.02
  Bottom 0.305: v52.83,12.45 v52.83,15.24 | v63.25,26.29 v66.04,26.29 | v72.77,34.54 73.79,34.54 74.42,35.18 74.42,39.88 v73.28,41.02
IO9  (via drill 0.41)
  Top 0.305: v47.75,24 46.61,22.86 v46.61,15.24 | v46.61,12.32 45.47,11.18 J6.9 | v61.34,28.96 61.4,28.96 U4.13
  Bottom 0.305: v61.34,28.96 60.83,28.45 59.44,28.45 58.93,27.94 54.74,27.94 53.98,28.7 51.82,28.7 47.75,24.64 v47.75,24 | v46.61,12.32 v46.61,15.24
MISO  (via drill 0.41)
  Top 0.305: v77.09,27.56 76.83,27.3 76.83,24.51 v77.09,24.26 | v62.48,30.73 63.02,30.73 U4.16 | J6.6 39.12,3.81 39.12,13.97 38.48,14.61 v37.85,14.61 | v48.77,29.46 48.77,26.67 48.13,26.04 44.96,26.04 44.83,26.16 44.2,26.16 43.43,25.4 43.43,24.77 44.2,24 44.7,24 45.09,23.62 45.09,22.48 44.32,21.72 41.66,21.72 40.51,20.57 v40.26,20.57
  Bottom 0.305: v77.09,27.56 73.91,30.73 69.34,30.73 67.69,32.38 64.39,32.38 62.74,30.73 v62.48,30.73 61.72,29.97 60.96,29.97 60.2,29.21 59.18,29.21 58.67,28.7 56.26,28.7 55.5,29.46 v48.77,29.46 | v77.09,24.26 74.3,21.46 71.37,21.46 J7.1 | v40.26,20.57 38.35,20.57 37.34,19.56 37.34,15.11 v37.85,14.61
MOSI  (via drill 0.41)
  Top 0.305: v65.91,30.73 65.91,30.23 65.41,29.72 65.41,28.7 64.9,28.19 64.42,28.19 U4.15
  Bottom 0.305: v65.91,30.73 66.04,30.86 67.18,30.86 68.83,29.21 73.15,29.21 73.91,28.45 73.91,25.4 | J7.4 73.91,25.4 | J6.7 40.39,6.6 42.04,8.26 50.42,8.26 51.31,9.14 66.67,9.14 68.83,11.3 68.83,12.83 68.45,13.21 68.45,19.43 69.72,20.7 74.93,20.7 78.11,23.88 78.11,25.27 73.91,25.27 73.91,25.4
N$1
  Top 0.305: U1.6 15.48,28.35 C6.1
N$2  (via drill 0.41)
  Top 0.305: U1.7 20.42,28.86 21.21,28.07 v21.21,27.94 | R20.1 33.4,41.66 v32.38,40.64
  Bottom 0.305: v21.21,27.94 24,25.15 28.7,25.15 30.48,26.92 30.48,38.73 v32.38,40.64
N$3
  Top 0.305: R8.2 2.07,48.73 J1.1 2.03,47.75 R9.1 R10.1
N$4  (via drill 0.41)
  Top 0.305: U1.3 14.29,30.8 13.84,30.35 11.43,30.35 | 11.43,30.35 11.05,30.35 v8.51,27.81 | v11.81,12.57 12.19,12.57 12.7,13.08 15.24,13.08 15.88,13.08 16.38,12.57 34.67,12.57 36.87,14.78 36.87,16.93 37.34,17.4 Q3.C | R1.2 11.43,30.35
  Bottom 0.305: v8.51,27.81 8.26,27.56 3.56,27.56 2.16,26.16 2.16,16.38 3.05,15.49 8.89,15.49 v11.81,12.57
N$5
  Top 1.016: D1.A 12.57,47.71 J1.4
N$6
  Top 0.305: R6.2 40.26,12.45 Q4.B
N$7
  Top 0.305: C10.1 11.43,4.7 | 11.43,4.7 11.43,6.06 R16.2 | R26.1 12.87,4.41 12.57,4.7 11.43,4.7 | R16.2 13.93,8.38 14.35,8.38 15.69,7.05 U3.4 16.48,10.89 17.27,11.68 36.37,11.68 Q4.C | TP7.TP 12.7,9.61 R16.2
N$8
  Top 0.305: Q2.2(S) 44.41,43.71 D3.A
N$9
  Top 0.305: J1.2 6.04,50.51 R2.2 R8.1
N$10
  Top 0.305: U1.11 21.17,31.45 21.76,32.04 C1.1
  Top 0.33: C1.1 22.95,31.92 23.24,31.62 24.11,31.62 D2.C
N$11  (via drill 0.41)
  Top 0.305: R10.2 4.19,42.67 5.08,41.78 v5.71,41.78 | v13.08,31.88 13.5,31.45 U1.2
  Bottom 0.305: v5.71,41.78 8.26,41.78 13.08,36.96 v13.08,31.88
N$12
  Top 0.305: Q8.E Q9.B 55.99,46.99 R33.1
N$13  (via drill 0.3, 0.41)
  Top 0.305: v42.55,26.67 42.67,26.54 42.67,23.66 R13.2 | 22.23,50.29 v22.48,50.04 22.1,50.42 D5.C
  Bottom 0.305: 42.8,43.94 42.8,44.7 39.75,47.75 37.21,47.75 36.83,48.13 33.78,48.13 33.27,47.62 31.11,47.62 30.1,46.61 28.83,46.61 27.94,47.5 27.94,49.02 27.18,49.78 25.27,49.78 24.77,50.29 22.73,50.29 v22.48,50.04 | 42.8,43.94 42.8,26.92 v42.55,26.67 | TP1.TP 42.8,43.94
N$14
  Top 0.305: Q7.2(S) 37.3,23.05 D6.A
N$15
  Top 0.305: U3.3 19.62,7.05 19.81,6.86 21.3,6.86 R14.2 | R24.1 22.19,4.79 C9.1 23.28,6.22 R14.2 | R14.2 22.77,7.53 TP6.TP
N$16  (via drill 0.41)
  Top 0.305: R17.2 39.24,25.44 39.24,20.57 38.17,19.5 Q7.1(G) 36.52,19.5 35.18,18.16 35.18,15.49 33.78,14.1 22.73,14.1 v22.48,14.35 | U3.1 20,5.15 v20.57,5.71
  Bottom 0.305: v20.57,5.71 21.08,5.71 21.46,6.1 21.46,13.34 v22.48,14.35
N$17  (via drill 0.41)
  Top 0.305: U3.6 15.81,5.15 15.49,4.83 v15.49,3.56 | v21.08,14.35 22.86,16.13 24.26,16.13 24.77,15.62 33.02,15.62 33.53,16.13 33.53,19.3 34.04,19.81 34.04,21.59 33.51,22.12 D6.C 34.16,23.24 35.81,24.89 35.81,26.42 36.83,27.43 36.83,33.91 v36.45,34.29 | v35.18,44.83 35.18,45 R18.2
  Bottom 0.305: 16.76,3.3 15.49,3.3 v15.49,3.56 13.84,1.91 S2.1 | 16.76,3.3 18.8,3.3 19.56,4.06 19.56,6.1 20.57,7.11 20.57,13.84 v21.08,14.35 | S1.2 16.8,3.26 16.76,3.3 | v36.45,34.29 36.45,35.31 36.96,35.81 36.96,40.89 36.2,41.66 36.2,43.81 v35.18,44.83
N$18  (via drill 0.41)
  Top 0.305: R7.2 38.61,29.84 38.23,29.46 38.23,28.83 37.72,28.32 37.72,27.3 36.58,26.16 36.58,25.15 37.08,24.64 37.97,24.64 38.48,24.13 38.48,20.95 37.97,20.45 Q7.3(D) 34.92,20.28 34.92,19.56 34.29,18.92 34.29,15.75 33.4,14.86 24,14.86 v23.75,15.11
  Bottom 0.305: S1.1 18.76,2.25 22.35,5.84 22.35,12.83 23.75,14.22 v23.75,15.11
N$19
  Top 0.305: R34.2 63.12,45.21 63.06,45.15 Q8.B 58.86,45.15 58.25,45.76 Q9.C
N$21
  Top 0.305: Q10.B 76.88,47.71 77.98,46.61 R37.2
N$22
  Top 0.305: R36.1 74.68,43.81 75.44,44.58 Q10.C
N$46  (via drill 0.41)
  Top 0.305: Q3.B 40.26,16.51 R5.2 42.16,16.47 42.16,15.62 v41.66,15.11 | R13.1 40.55,23.66 v41.53,24.64
  Bottom 0.305: v41.66,15.11 42.8,16.26 42.8,22.48 41.53,23.75 v41.53,24.64
N$115
  Top 0.305: U4.7 53.72,22.32 53.72,21.97 54.27,21.42 Y1.1 54.27,19.22 53.85,18.8 C17.2
N$116
  Top 0.305: U4.8 57.02,24.49 57.02,23.37 59.77,20.62 Y1.2 59.77,19.39 58.8,18.41 C18.2
NTC1  (via drill 0.33, 0.41)
  Top 0.305: U1.8 20.91,29.5 21.46,28.96 21.72,28.96 22.23,28.45 v22.23,25.65 | v32.51,25.65 32.51,30.86 v32.26,31.11
  Bottom 0.305: v22.23,25.65 22.48,25.65 23.75,24.38 31.24,24.38 v32.51,25.65 | v32.26,31.11 R19.1
PL
  Top 0.305: R37.1 80.77,46.61 81.41,47.24 | 81.41,47.24 81.41,48.6 R38.2 | J8.2 81.53,47.37 81.41,47.24
PV_IN
  Top 0.305: R2.1 7.96,49.87 7.49,49.4 7.49,47.37 8.76,46.1 R28.2 9.74,44.83 TP5.TP 10.54,44.07 11.69,42.92
  pour Top (isolate 0.406, no thermals): 11.68,43.05 13.46,43.05 13.46,39.62 16.89,39.62 16.89,37.72 12.57,37.72 12.57,34.92 13.21,34.29 14.48,34.29 16,32.77 16,32.13 14.35,32.13 13.21,33.27 10.79,33.27 10.79,38.99 11.68,39.88
PWR  (via drill 0.33, 0.41)
  Top 0.305: U1.9 21.66,30.16 v21.97,29.84 | 36.96,43.81 C2.1 35.43,43.81 34.8,43.18 34.8,39.5 | 36.96,43.81 39.16,43.81 R4.1 | Q1.2(S) 38.14,36.02 40.13,34.04 40.13,30.1 39.12,29.08 R17.1 38.7,27.14 37.47,25.91 v37.47,25.65 | v34.67,10.67 29.84,10.67 | 29.84,10.67 23.15,10.67 R14.1 21.5,9.49 20.45,10.54 18.29,10.54 17.78,10.03 C11.1 17.78,6.86 17.02,6.1 U3.5 15.24,6.1 14.82,6.52 R16.1 | R31.2 36.83,45.09 36.96,44.96 36.96,43.81 | TP4.TP 29.84,10.67
  Top 0.33: D2.A 25.3,35.2 v25.4,35.31 | R21.1 27.69,44.32
  Top 1.016: R11.1 29.97,39.5 28.83,40.64 28.83,43.18 27.69,44.32 27.18,44.83 25.91,44.83 25.4,44.32 23.54,44.32 Q5.3(D) | Q1.2(S) 37.53,37.91 35.94,39.5 34.8,39.5 R3.1
  Bottom 0.305: v21.97,29.84 22.23,29.59 22.23,28.19 24.51,25.91 28.45,25.91 29.72,27.18 29.72,37.97 28.83,38.86 v28.45,38.86 | v37.47,25.65 36.83,25.65 36.2,25.02 36.2,12.19 v34.67,10.67
  Bottom 0.33: v25.4,35.31 25.4,37.34 v24.77,37.97
  pour Top (isolate 0.406, no thermals): 35.56,40.26 35.43,38.48 27.69,38.48 26.92,37.72 22.35,37.72 22.35,39.62 26.92,39.62 27.18,39.88 28.45,39.88 28.83,40.26
RX  (via drill 0.41)
  Top 0.305: v54.61,34.29 54.61,33.53 55.24,32.89 U4.30 | v76.07,30.1 76.07,23.62 76.58,23.11 76.58,14.86 73.03,11.3 v73.03,5.08
  Bottom 0.305: v54.61,34.29 56.52,36.2 60.83,36.2 62.23,37.59 69.47,37.59 71.75,35.31 71.75,34.04 72.26,33.53 72.26,31.88 72.52,31.62 74.55,31.62 v76.07,30.1 | v73.03,5.08 70.48,2.54 J5.3
SCK  (via drill 0.41)
  Top 0.305: v64.77,30.48 64.77,31.11 64.26,31.62 U4.17
  Bottom 0.305: v64.77,30.48 64.77,30.1 65.28,29.59 67.44,29.59 68.58,28.45 68.58,25.4 | J7.3 68.58,25.4 | 68.58,25.4 67.82,24.89 67.82,20.07 67.56,19.81 67.56,12.7 67.82,12.45 67.82,11.3 66.42,9.91 51.05,9.91 50.16,9.02 41.78,9.02 J6.5
SCL1  (via drill 0.41)
  Top 0.305: v59.31,34.16 59.31,29.08 57.02,26.8 U4.6 | v71.25,33.02 70.23,32 70.23,30.86 69.85,30.48 69.22,30.48 67.82,29.08 67.82,27.94 67.06,27.18 67.06,24.51 v66.8,24.26 | v66.8,11.68 66.8,5.08 67.31,4.57 70.36,4.57 J5.2
  Bottom 0.305: v59.31,34.16 60.58,35.43 61.21,35.43 62.61,36.83 69.22,36.83 70.99,35.05 70.99,33.4 71.25,33.15 v71.25,33.02 | v66.8,11.68 v66.8,24.26
SDA1  (via drill 0.41)
  Top 0.305: v56.64,29.72 55.37,28.45 U4.3 | v71.25,31.62 71.37,31.5 71.37,30.73 70.23,29.59 69.34,29.59 68.58,28.83 68.58,27.56 67.82,26.8 67.82,21.34 v69.85,19.3 | v77.47,17.27 77.34,17.14 77.34,14.35 73.91,10.92 73.91,5.84 74.17,5.59 74.17,4.19 74.93,3.43 J5.1
  Bottom 0.305: v56.64,29.72 56.64,30.86 57.02,31.24 57.4,31.24 58.04,31.88 59.56,31.88 61.59,33.91 62.23,33.91 63.63,35.31 68.07,35.31 68.71,34.67 68.71,32.38 69.6,31.5 71.12,31.5 v71.25,31.62 | v69.85,19.3 71.88,17.27 v77.47,17.27
SENSE  (via drill 0.41)
  Top 0.305: U1.10 22.28,30.8 22.99,30.1 22.99,28.83 v23.24,28.57 | v28.7,34.42 29.21,34.92 29.21,35.81
  Bottom 0.305: v23.24,28.57 23.24,28.19 24.77,26.67 28.07,26.67 28.96,27.56 28.96,34.16 v28.7,34.42
  pour Top (isolate 0.406, no thermals): 29.08,37.47 35.69,37.47 35.69,27.56 33.27,27.56 33.27,35.81 29.08,35.81
SW
  pour Top (isolate 0.406, no thermals): 19.43,32.13 19.43,32.26 19.68,32.51 20.07,32.51 21.34,33.78 21.34,34.16 20.57,34.92 19.18,34.92 19.18,35.81 20.45,35.81 21.72,34.54 22.48,34.54 23.11,33.91 25.53,33.91 27.3,32.13 27.3,29.59 25.78,29.59 25.65,32.64 25.15,33.15 22.73,33.15 22.35,33.53 22.23,33.53 20.83,32.13
TC+
  Top 0.305: R22.1 30.52,43.52 29.08,44.96 29.08,45.55 R21.2 27.36,46.95 J2.3
TC-
  Top 0.305: J2.4 30.27,47.55 R23.2 30.27,45.55 30.99,44.83 31.5,44.83 31.75,44.58 32.73,44.58 R20.2 33.36,43.9 31.03,41.57 R22.2
TX  (via drill 0.41)
  Top 0.305: v49.15,31.75 50.67,33.27 53.72,33.27 54.74,32.26 U4.31 | v51.69,31.5 51.94,31.24 v51.94,26.8 | v51.94,24 50.93,22.99 50.93,19.81 51.69,19.05 v51.69,15.75 | v51.69,12.95 51.05,12.32 v51.05,7.49
  Bottom 0.305: v49.15,31.75 49.4,31.5 v51.69,31.5 | v51.94,24 v51.94,26.8 | v51.69,12.95 v51.69,15.75 | v51.05,7.49 51.94,8.38 68.07,8.38 68.96,7.49 68.96,4.19 J5.4
VIN
  Top 0.305: Q2.1(G) 44.41,40.05 44.64,39.81 | U2.1 42.52,38.76 42.42,38.86 | 52.07,47.24 52.32,47.12 52.32,47.03 R33.2 54.2,45.15 Q9.E
  Top 1.016: Q1.3(D) 42.42,38.86 43.69,38.86 44.64,39.81 44.96,40.13 46.1,40.13 49.66,43.69 49.66,44.83 52.07,47.24 J3.1

### Text on the board
tPlace: RPUno | 14140^3 | EPCCS.ORG
bPlace: NC | IOREF | !RST | NC | 5V | 0V | 0V | VIN | A0 | A1 | A2 | A3 | A4 | A5 | A6 | A7 | 0V | NC | NC | IOREF 5V | !RESET | NC | 5V | 0V | 0V | VIN | ADC0/MISO1 C0 | ADC1/SCK1 C1 | ADC2 C2 | ADC3 C3 | C4 | C5 | E2 | E3 | 0V | NC | PULSE / LOOP | 20mA | ADC4/SDA0 | ADC5/SCL0 | ADC6/ICP3/!SS1! | ADC7/T3/MOSI1 | B=4250 / 100K | 36 CELL / STRING | -PV | +PV | -BAT | +BAT | B=4250 / 100K | 6V / SLA | 6.71V:50.7k@40ºC / 6.8365V:100k@25ºC / 7.048V:357k@0ºC | CHARGE RATE IS FUNCTION / OF PV POWER UP TO MAX, / ABOUT 0.11A PER WATT. | LT3652 /W R19 @ / 10k B=3380 THERMISTOR / 0ºC < CHRG < 40ºC | 0V | MPP IDEAL:ACTUAL / 13.8:14.5V-15.2k@70ºC / 15.8:15.7V-50.7k@40ºC / 17:16.8V-100k@25ºC / 19:18.7V-357k@0ºC | !RESET | MOSI | SCK | RPUno | IOREF | MISO | EPCCS.ORG | 14140^3 | SPI | POWER MCU AT 6.58V / DISCONNECT AT 5.88V. | PWR | S1: VIN / CONNECT | C5 SCL0 | C4 SDA0 | 0V | D6 OC0A | D5 OC0B/T1 | D4 T0 | D3 INT1/OC2B | D2 INT0/OC3B | D1 TX0 | D0 RX0 | E1 SCL1/T4 | E0 SDA1/ICP4 | S2: CONNECT / BAT TO CC | NC | B5 SCK | B4 MISO/RX1 | B3 MOSI/OC2A/TX1 | B2 !SS!/OC1B | B1 OC1A | B0 ICP1 | D7 | SCL | SDA | NC | 0V | 13 | 12 | 11 | 10 | 9 | 8 | 7 | 6 | 5 | 4 | 3 | 2 | 1 | 0